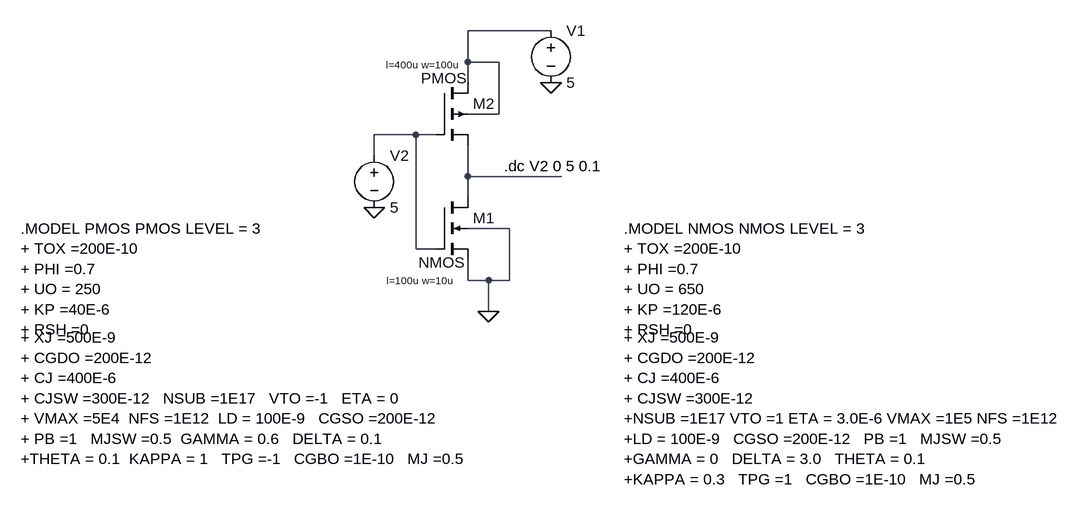
[diagram p0: schematic CMOS Inverter VTC.asc]
CMOS Inverter VTC.asc, the LTspice schematic file:
Version 4
SHEET 1 1332 680
WIRE 496 -320 368 -320
WIRE 368 -272 368 -320
WIRE 416 -272 368 -272
WIRE 368 -240 368 -272
WIRE 416 -192 416 -272
WIRE 416 -192 368 -192
WIRE 288 -160 224 -160
WIRE 320 -160 288 -160
WIRE 224 -128 224 -160
WIRE 368 -96 368 -144
WIRE 512 -96 368 -96
WIRE 368 -64 368 -96
WIRE 432 -16 368 -16
WIRE 288 16 288 -160
WIRE 320 16 288 16
WIRE 368 64 368 32
WIRE 400 64 368 64
WIRE 432 64 432 -16
WIRE 432 64 400 64
WIRE 400 112 400 64
FLAG 496 -240 0
FLAG 224 -48 0
FLAG 400 112 0
SYMBOL nmos4 320 -64 R0
WINDOW 3 -28 101 Left 2
WINDOW 123 -77 128 Left 1
SYMATTR Value2 l=100u w=10u
SYMATTR InstName M1
SYMBOL pmos4 320 -240 R0
WINDOW 3 -24 -7 Left 2
WINDOW 123 -78 -28 Left 1
SYMATTR Value2 l=400u w=100u
SYMATTR InstName M2
SYMBOL voltage 224 -144 R0
WINDOW 123 0 0 Left 0
WINDOW 39 0 0 Left 0
SYMATTR InstName V2
SYMATTR Value 5
SYMBOL voltage 496 -336 R0
WINDOW 123 0 0 Left 0
WINDOW 39 0 0 Left 0
SYMATTR InstName V1
SYMATTR Value 5
TEXT 608 -16 Left 2 !.MODEL NMOS NMOS LEVEL = 3\n+ TOX =200E-10\n+ PHI =0.7\n+ UO = 650\n+ KP =120E-6\n+ RSH =0
TEXT 608 152 Left 2 !+ XJ =500E-9\n+ CGDO =200E-12\n+ CJ =400E-6\n+ CJSW =300E-12\n+NSUB =1E17 VTO =1 ETA = 3.0E-6 VMAX =1E5 NFS =1E12\n+LD = 100E-9   CGSO =200E-12   PB =1   MJSW =0.5\n+GAMMA = 0   DELTA = 3.0   THETA = 0.1\n+KAPPA = 0.3   TPG =1   CGBO =1E-10   MJ =0.5
TEXT -320 -16 Left 2 !.MODEL PMOS PMOS LEVEL = 3\n+ TOX =200E-10\n+ PHI =0.7\n+ UO = 250\n+ KP =40E-6\n+ RSH =0
TEXT -320 152 Left 2 !+ XJ =500E-9\n+ CGDO =200E-12\n+ CJ =400E-6\n+ CJSW =300E-12   NSUB =1E17   VTO =-1   ETA = 0\n+ VMAX =5E4  NFS =1E12  LD = 100E-9   CGSO =200E-12  \n+ PB =1   MJSW =0.5  GAMMA = 0.6   DELTA = 0.1   \n+THETA = 0.1  KAPPA = 1   TPG =-1   CGBO =1E-10   MJ =0.5
TEXT 424 -112 Left 2 !.dc V2 0 5 0.1

The netlist it stands for:
* CMOS Inverter VTC.asc
M1 N003 N002 0 0 NMOS l=100u w=10u
M2 N001 N002 N003 N001 PMOS l=400u w=100u
V2 N002 0 5
V1 N001 0 5
.model NMOS NMOS
.model PMOS PMOS
.lib standard.mos
.MODEL NMOS NMOS LEVEL = 3
+ TOX =200E-10
+ PHI =0.7
+ UO = 650
+ KP =120E-6
+ RSH =0
+ XJ =500E-9
+ CGDO =200E-12
+ CJ =400E-6
+ CJSW =300E-12
+NSUB =1E17 VTO =1 ETA = 3.0E-6 VMAX =1E5 NFS =1E12
+LD = 100E-9   CGSO =200E-12   PB =1   MJSW =0.5
+GAMMA = 0   DELTA = 3.0   THETA = 0.1
+KAPPA = 0.3   TPG =1   CGBO =1E-10   MJ =0.5
.MODEL PMOS PMOS LEVEL = 3
+ TOX =200E-10
+ PHI =0.7
+ UO = 250
+ KP =40E-6
+ RSH =0
+ XJ =500E-9
+ CGDO =200E-12
+ CJ =400E-6
+ CJSW =300E-12   NSUB =1E17   VTO =-1   ETA = 0
+ VMAX =5E4  NFS =1E12  LD = 100E-9   CGSO =200E-12
+ PB =1   MJSW =0.5  GAMMA = 0.6   DELTA = 0.1
+THETA = 0.1  KAPPA = 1   TPG =-1   CGBO =1E-10   MJ =0.5
.dc V2 0 5 0.1
.backanno
.end